# Altium schematic sheet Top.SchDoc
size 209 x 297 mm; PageSetup: Record=PageOptions|CenterHorizontal=True|CenterVertical=True|PrintScale=1.00|XCorrection=1.00|YCorrection=1.00|PrintKind=1|BorderSize=5000000|LeftOffset=0|BottomOffset=0|Orientation=2|PaperLength=1000|PaperWidth=1000|Scale=100|PaperSource=15|PrintQuality=1200|MediaType=1|DitherType=10|PaperKind=A3|PrintScaleMode=1; ListNumber: 1; SheetNumber: 1; SheetTotal: 6
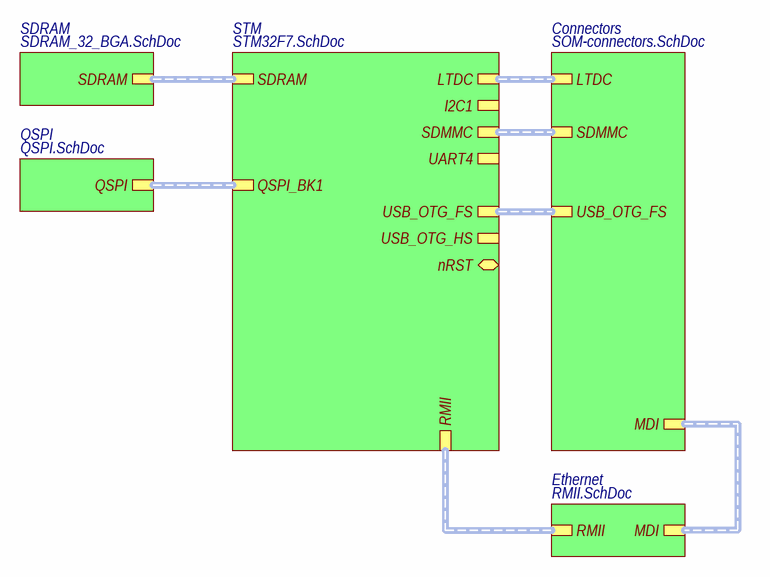
[diagram p0: Top.SchDoc]

## Sub-sheets
Connectors = SOM-connectors.SchDoc: LTDC (harness LTDC), MDI (harness MDI), SDMMC (harness SDMMC), USB_OTG_FS (harness USB_OTG)
Ethernet = RMII.SchDoc: RMII (harness RMII), MDI (harness MDI)
QSPI = QSPI.SchDoc: QSPI (harness RGMII)
SDRAM = SDRAM_32_BGA.SchDoc: SDRAM (harness SDRAM)
STM = STM32F7.SchDoc: SDRAM (harness SDRAM), QSPI_BK1 (harness QSPI), UART4 (harness UART), SDMMC (harness SDMMC), I2C1 (harness I2C), USB_OTG_FS (harness USB_OTG), USB_OTG_HS (harness USB_OTG), LTDC (harness LTDC), RMII (harness RMII), nRST (bidir)

## Buses and harness runs
harness sheet Connectors/LTDC = sheet STM/LTDC
harness sheet Connectors/MDI = sheet Ethernet/MDI
harness sheet Connectors/SDMMC = sheet STM/SDMMC
harness sheet Connectors/USB_OTG_FS = sheet STM/USB_OTG_FS
harness sheet Ethernet/RMII = sheet STM/RMII
harness sheet QSPI/QSPI = sheet STM/QSPI_BK1
harness sheet SDRAM/SDRAM = sheet STM/SDRAM

## Notes on the sheet
- Перв. примен.
- Справ. №
- Подп. и дата
- Инв. № дубл.
- Взам. инв. №
- Разраб.
- Изм.
- Лист
- № докум.
- Подп.
- Дата
- Лит.
- Масса
- Масштаб
- Пров.
- Т. контр.
- Листов
- Инв. № подл.
- Н. контр.
- Утв.
- Копировал
- Формат А4